# EAGLE design microframe (EAGLE 5.10)
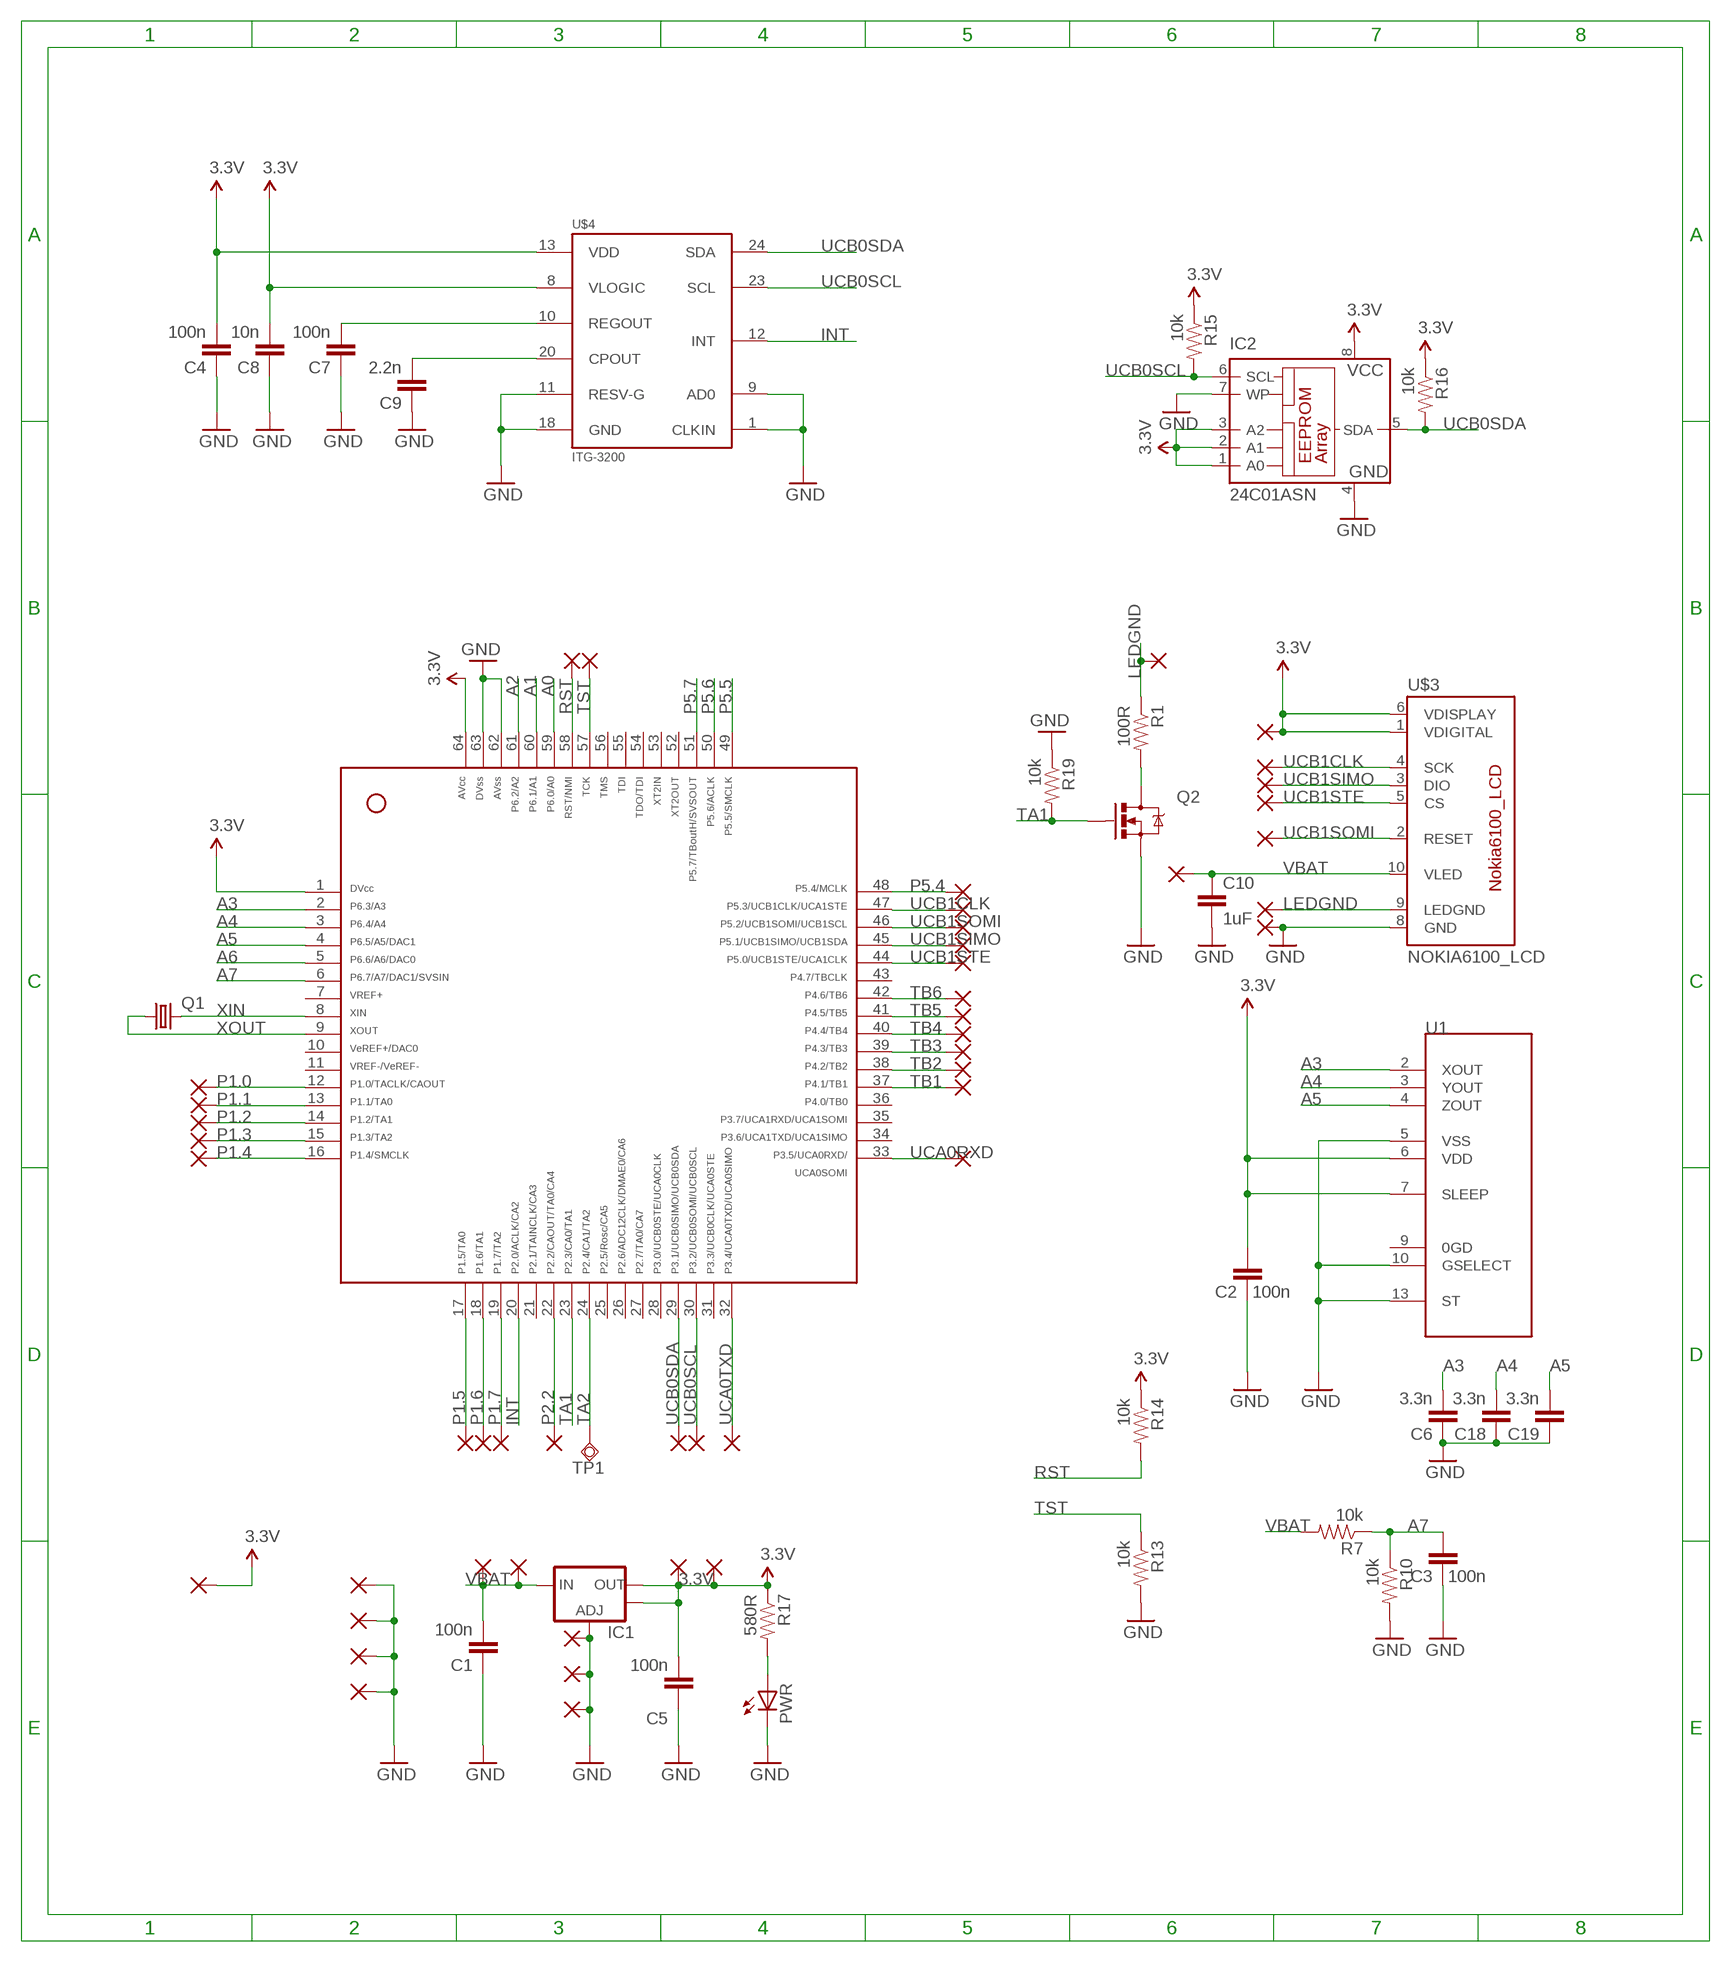
[diagram p0: schematic, sheet 1]

## Parts
C1  100n  CAP0805  [0805]
C2  100n  CAP0805  [0805]
C3  100n  CAP0805  [0805]
C4  100n  CAP0805  [0805]
C5  100n  CAP0805  [0805]
C6  3.3n  CAP0805  [0805]
C7  100n  CAP0805  [0805]
C8  10n  CAP0805  [0805]
C9  2.2n  CAP0805  [0805]
C10  1uF  CAP0805  [0805]
C18  3.3n  CAP0805  [0805]
C19  3.3n  CAP0805  [0805]
IC1  V_REG_LM1117SOT223  [SOT223]
IC2  24C01ASN  [SO-08]
PAD1  SMD2  [SMD1,27-2,54]
PAD2  SMD2  [SMD1,27-2,54]
PAD3  SMD2  [SMD1,27-2,54]
PAD4  SMD2  [SMD1,27-2,54]
PAD5  SMD2  [SMD1,27-2,54]
PAD6  SMD2  [SMD1,27-2,54]
PAD7  SMD2  [SMD1,27-2,54]
PAD8  SMD2  [SMD1,27-2,54]
PAD9  SMD2  [SMD1,27-2,54]
PAD10  SMD2  [SMD1,27-2,54]
PAD11  SMD2  [SMD1,27-2,54]
PAD12  SMD2  [SMD1,27-2,54]
PAD13  SMD2  [SMD1,27-2,54]
PAD14  SMD2  [SMD1,27-2,54]
PAD15  SMD2  [SMD1,27-2,54]
PAD16  SMD2  [SMD1,27-2,54]
PAD17  SMD2  [SMD1,27-2,54]
PAD18  SMD2  [SMD1,27-2,54]
PAD19  SMD2  [SMD1,27-2,54]
PAD20  SMD2  [SMD1,27-2,54]
PAD21  SMD2  [SMD1,27-2,54]
PAD22  SMD2  [SMD1,27-2,54]
PAD23  SMD2  [SMD1,27-2,54]
PAD24  SMD2  [SMD1,27-2,54]
PAD25  SMD2  [SMD1,27-2,54]
PAD26  SMD2  [SMD1,27-2,54]
PAD27  SMD2  [SMD1,27-2,54]
PAD28  SMD2  [SMD1,27-2,54]
PAD29  SMD2  [SMD1,27-2,54]
PAD30  SMD2  [SMD1,27-2,54]
PAD31  SMD2  [SMD1,27-2,54]
PAD32  SMD2  [SMD1,27-2,54]
PAD33  SMD2  [SMD1,27-2,54]
PAD34  SMD2  [SMD1,27-2,54]
PAD35  SMD2  [SMD1,27-2,54]
PAD36  SMD2  [SMD1,27-2,54]
PAD37  SMD2  [SMD1,27-2,54]
PAD38  SMD2  [SMD1,27-2,54]
PAD39  SMD2  [SMD1,27-2,54]
PAD40  SMD2  [SMD1,27-2,54]
PAD41  SMD2  [SMD1,27-2,54]
PAD42  SMD2  [SMD1,27-2,54]
PAD43  SMD2  [SMD1,27-2,54]
PAD44  SMD2  [SMD1,27-2,54]
PAD45  SMD2  [SMD1,27-2,54]
PAD46  SMD2  [SMD1,27-2,54]
PAD47  SMD2  [SMD1,27-2,54]
PWR  LEDCHIPLED_0603  [CHIPLED_0603]
Q1  CRYSTALHC49S  [HC49/S]
Q2  MOSFET-NCHANNELSMD  [SOT23-3]
R1  100R  RESISTOR  [0805]
R7  10k  RESISTOR  [0805]
R10  10k  RESISTOR  [0805]
R13  10k  RESISTOR  [0805]
R14  10k  RESISTOR  [0805]
R15  10k  RESISTOR  [0805]
R16  10k  RESISTOR  [0805]
R17  580R  RESISTOR  [0805]
R19  10k  RESISTOR  [0805]
TP1  TPSQTP13R  [TP13R]
U1  MMA7361  [LGA14]
U$1  F261X---PM64  [PM/PAG64]
U$3  NOKIA6100_LCD  [NOKIA6100_LCD]
U$4  ITG-3200  [QFN-24]

## Nets
3.3V: C2.2 C4.2 C5.2 C8.2 IC1.2(OUT) IC1.4(OUT) IC2.1(A0) IC2.2(A1) IC2.3(A2) IC2.8(VCC) PAD26.1(P) PAD28.1(P) PAD36.1(P) PAD44.1(P) R14.1 R15.1 R16.1 R17.1 U1.6(VDD) U1.7(SLEEP) U$1.1 U$1.64 U$3.1(VDIGITAL) U$3.6(VDISPLAY) U$4.8(VLOGIC) U$4.13(VDD)
A0: U$1.59
A1: U$1.60
A2: U$1.61
A3: C6.2 U1.2(XOUT) U$1.2
A4: C18.2 U1.3(YOUT) U$1.3
A5: C19.2 U1.4(ZOUT) U$1.4
A6: U$1.5
A7: C3.2 R7.1 R10.1 U$1.6
GND: C1.1 C2.1 C3.1 C4.1 C5.1 C6.1 C7.1 C8.1 C9.1 C10.2 C18.1 C19.1 IC1.1(ADJ) IC2.4(GND) IC2.7(WP) PAD22.1(P) PAD23.1(P) PAD24.1(P) PAD25.1(P) PAD37.1(P) PAD43.1(P) PAD46.1(P) PAD47.1(P) PWR.C Q2.2(S) R10.2 R13.2 R19.1 U1.5(VSS) U1.10(GSELECT) U1.13(ST) U$1.62 U$1.63 U$3.8(GND) U$4.1(CLKIN) U$4.9(AD0) U$4.11(RESV-G) U$4.18(GND)
INT: U$1.20 U$4.12(INT)
LEDGND: PAD35.1(P) PAD45.1(P) R1.1 U$3.9(LEDGND)
N$1: C9.2 U$4.20(CPOUT)
N$2: C7.2 U$4.10(REGOUT)
N$3: PWR.A R17.2
N$4: Q2.3(D) R1.2
P1.0: PAD1.1(P) U$1.12
P1.1: PAD2.1(P) U$1.13
P1.2: PAD3.1(P) U$1.14
P1.3: PAD4.1(P) U$1.15
P1.4: PAD5.1(P) U$1.16
P1.5: PAD6.1(P) U$1.17
P1.6: PAD7.1(P) U$1.18
P1.7: PAD8.1(P) U$1.19
P2.2: PAD9.1(P) U$1.22
P5.4: PAD29.1(P) U$1.48
P5.5: U$1.49
P5.6: U$1.50
P5.7: U$1.51
RST: PAD20.1(P) R14.2 U$1.58
TA1: Q2.1(G) R19.2 U$1.23
TA2: TP1.TP U$1.24
TB1: PAD10.1(P) U$1.37
TB2: PAD11.1(P) U$1.38
TB3: PAD12.1(P) U$1.39
TB4: PAD13.1(P) U$1.40
TB5: PAD14.1(P) U$1.41
TB6: PAD15.1(P) U$1.42
TST: PAD21.1(P) R13.1 U$1.57
UCA0RXD: PAD39.1(P) U$1.33
UCA0TXD: PAD38.1(P) U$1.32
UCB0SCL: IC2.6(SCL) PAD40.1(P) R15.2 U$1.30 U$4.23(SCL)
UCB0SDA: IC2.5(SDA) PAD41.1(P) R16.2 U$1.29 U$4.24(SDA)
UCB1CLK: PAD19.1(P) PAD30.1(P) U$1.47 U$3.4(SCK)
UCB1SIMO: PAD17.1(P) PAD31.1(P) U$1.45 U$3.3(DIO)
UCB1SOMI: PAD18.1(P) PAD33.1(P) U$1.46 U$3.2(RESET)
UCB1STE: PAD16.1(P) PAD32.1(P) U$1.44 U$3.5(CS)
VBAT: C1.2 C10.1 IC1.3(IN) PAD27.1(P) PAD34.1(P) PAD42.1(P) R7.2 U$3.10(VLED)
XIN: Q1.2 U$1.8
XOUT: Q1.1 U$1.9
Unconnected: U1.9(0GD) U$1.7 U$1.10 U$1.11 U$1.21 U$1.25 U$1.26 U$1.27 U$1.28 U$1.31 U$1.34 U$1.35 U$1.36 U$1.43 U$1.52 U$1.53 U$1.54 U$1.55 U$1.56

## Library data of the parts
C1-C10 C18 C19 = SparkFun:CAP: Capacitor Standard 0603 ceramic capacitor, and 0.1" leaded capacitor.
IC1 = SparkFun:V_REG_LM1117: Voltage Regulator LM1117 Standard adjustable voltage regulator but in SMD form. Spark Fun Electronics SKU : COM-00595
IC2 = microchip:24C*: Serial EEPROM 1 K/2 K/4 K
PAD1-PAD47 = wirepad:SMD2: SMD PAD
PWR = led:LED: LED OSRAM: - CHIPLED LG R971, LG N971, LY N971, LG Q971, LY Q971, LO R971, LY R971 LH N974, LH R974 LS Q976, LO Q976, LY Q976 LO Q996 - Hyper CHIPLED LW Q18S LB Q993, LB Q99A, LB R99A - SideLED LS A670, LO A670, LY A670, LG A670, LP A670 LB A673, LV A673, LT A673, LW A673 LH A674 LY A675 LS A676, LA A676, LO A676, LY A676, LW A676 LS A679, LY A679, LG A679 - Hyper Micro SIDELED® LS Y876, LA Y876, LO Y876, LY Y876 LT Y87S - SmartLED LW L88C, LW L88S LB L89C, LB L89S, LG L890 LS L89K, LO L89K, LY L89K LS L896, LA L896, LO L896, LY L896 - TOPLED LS T670, LO T670, LY T670, LG T670, LP T670 LSG T670, LSP T670, LSY T670, LOP T670, LYG T670 LG T671, LOG T671, LSG T671 LB T673, LV T673, LT T673, LW T673 LH T674 LS T676, LA T676, LO T676, LY T676, LB T676, LH T676, LSB T676, LW T676 LB T67C, LV T67C, LT T67C, LS T67K, LO T67K, LY T67K, LW E67C LS E67B, LA E67B, LO E67B, LY E67B, LB E67C, LV E67C, LT E67C LW T67C LS T679, LY T679, LG T679 LS T770, LO T770, LY T770, LG T770, LP T770 LB T773, LV T773, LT T773, LW T773 LH T774 LS E675, LA E675, LY E675, LS T675 LS T776, LA T776, LO T776, LY T776, LB T776 LHGB T686 LT T68C, LB T68C - Hyper Mini TOPLED® LB M676 - Mini TOPLED Santana® LG M470 LS M47K, LO M47K, LY M47K Source: http://www.osram.convergy.de LUXEON: - LUMILED® LXK2-PW12-R00, LXK2-PW12-S00, LXK2-PW14-U00, LXK2-PW14-V00 LXK2-PM12-R00, LXK2-PM12-S00, LXK2-PM14-U00 LXK2-PE12-Q00, LXK2-PE12-R00, LXK2-PE12-S00, LXK2-PE14-T00, LXK2-PE14-U00 LXK2-PB12-K00, LXK2-PB12-L00, LXK2-PB12-M00, LXK2-PB14-N00, LXK2-PB14-P00, LXK2-PB14-Q00 LXK2-PR12-L00, LXK2-PR12-M00, LXK2-PR14-Q00, LXK2-PR14-R00 LXK2-PD12-Q00, LXK2-PD12-R00, LXK2-PD12-S00 LXK2-PH12-R00, LXK2-PH12-S00 LXK2-PL12-P00, LXK2-PL12-Q00, LXK2-PL12-R00 Source: www.luxeon.com KINGBRIGHT: KA-3528ASYC Source: www.kingbright.com
Q1 = crystal:CRYSTAL: CRYSTAL
Q2 = SparkFun:MOSFET-NCHANNEL
R1 R7 R10 R13-R17 R19 = SparkFun:RESISTOR: Resistor Basic schematic elements and footprints for 0603, 1206, and PTH 1/10th watt (small) resistors.
TP1 = testpad:TPSQ: Test pad
U1 = SparkFun:MMA7361
U$1 = TI_MSP430_v15:F261X---PM64: ***MSP430F261x***PM64
U$3 = SparkFun:NOKIA6100_LCD: Nokia 6100 Color LCD Schematic element and footprint production proven but could use some touching up. Spark Fun Electronics SKU : LCD-00569. Mating SMD connector : LCD-00570
U$4 = SparkFun:ITG-3200: ITG-3200 3-axis gyro, digital output, qfn24 package

## Board
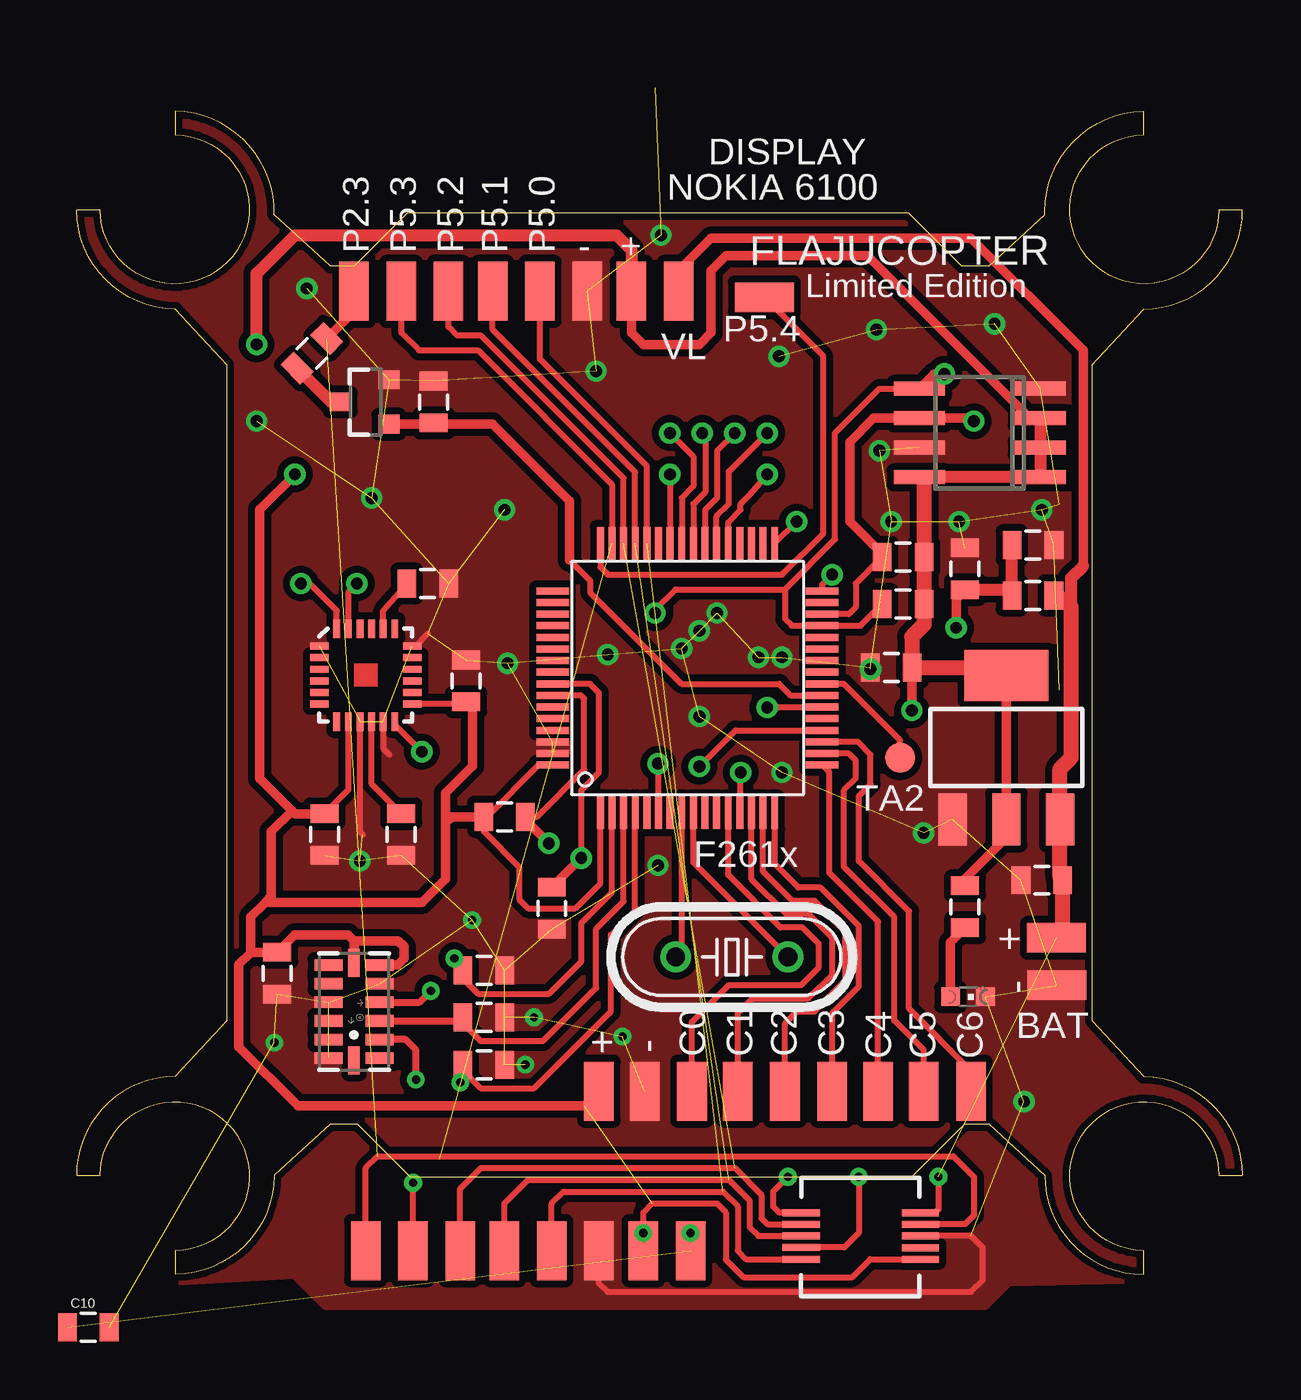
[diagram p1: board, top side]
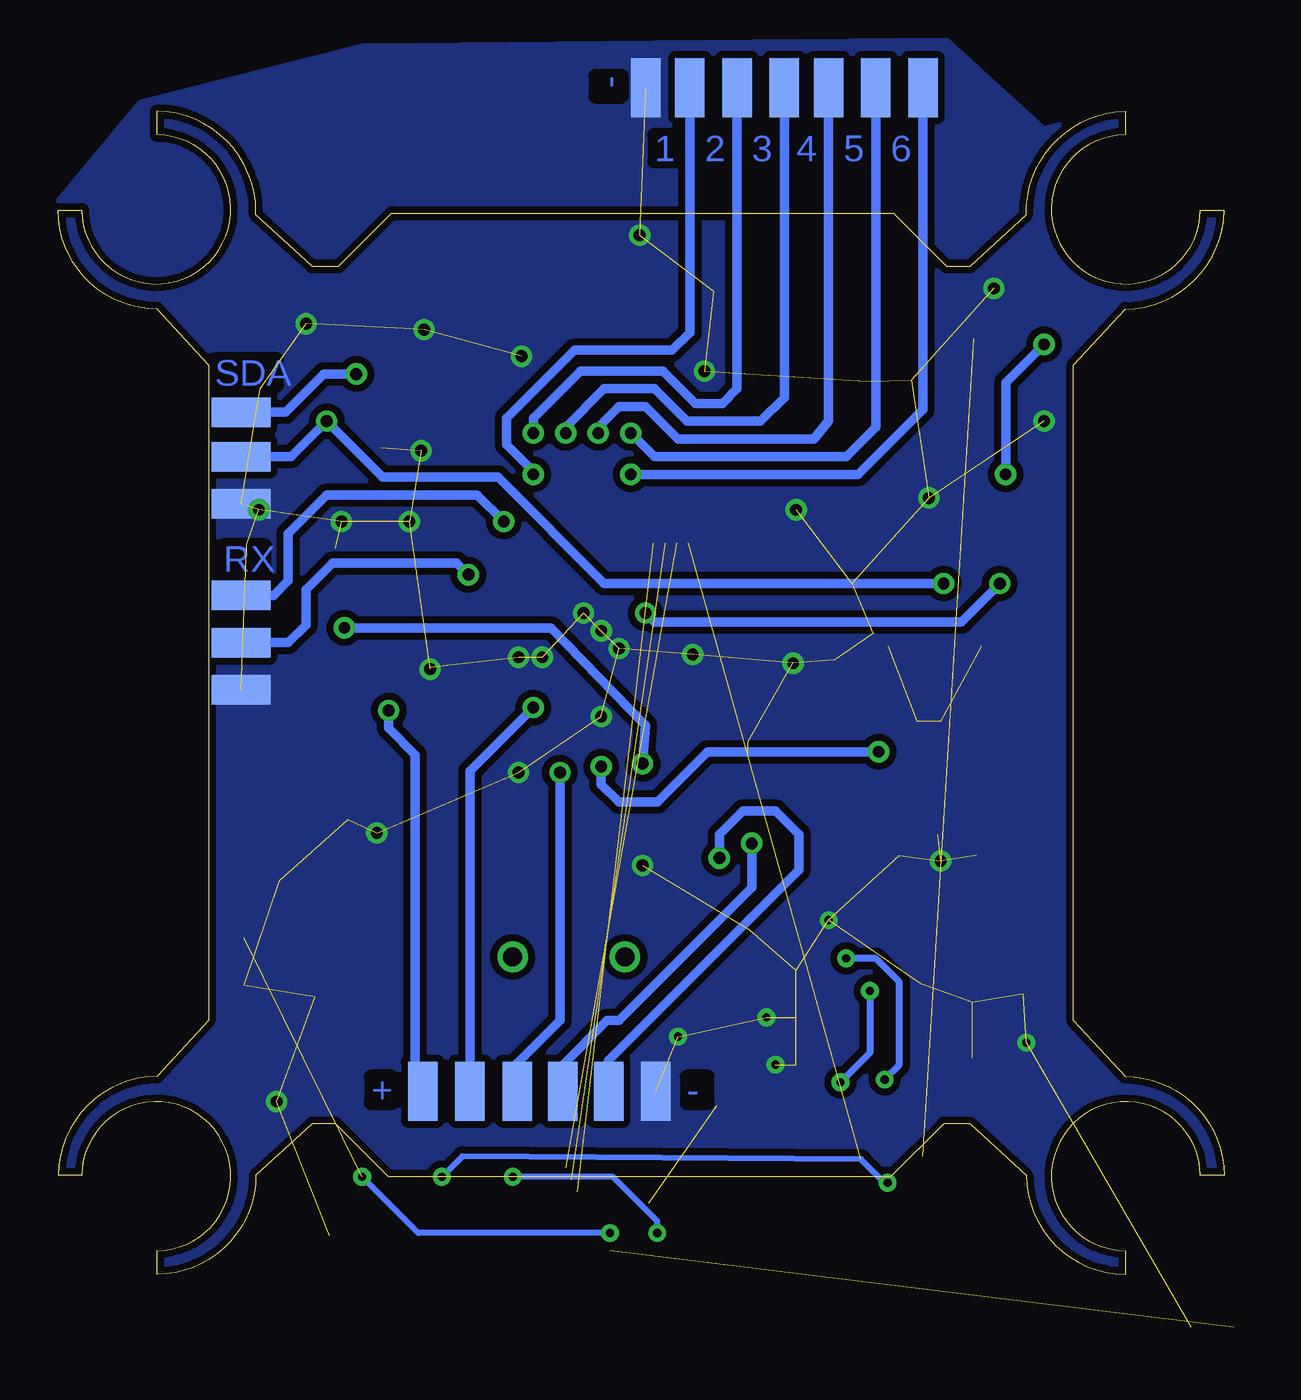
[diagram p2: board, bottom side, seen from below]

Size 50.17 x 50.04 mm. Coordinates in mm from the lower left corner, seen from the top.
Outline: 6.48,10.92 4.25,8.51 arc90 0,4.25 1.02,4.25 arc-269 4.25,1.02 4.25,0 arc89 8.51,4.25 10.92,6.48 12.07,6.48 14.35,4.19 35.94,4.19 38.23,6.48 39.24,6.48 41.66,4.25 arc90 45.91,0 45.91,1.02 arc-269 49.15,4.25 50.17,4.25 arc89 45.91,8.51 43.69,10.92 43.69,39.12 45.91,41.53 arc90 50.17,45.78 49.15,45.78 arc-269 45.91,49.02 45.91,50.04 arc89 41.66,45.72 41.66,45.59 39.24,43.37 38.1,43.37 35.81,45.66 14.22,45.66 11.94,43.37 10.92,43.37 8.51,45.59 arc90 4.25,50.04 4.25,49.02 arc-269 1.02,45.78 0,45.78 arc89 4.25,41.53 6.48,39.12 6.48,10.92
Copper layers (1*16): Top 0.035mm / dielectric 1.5mm / Bottom 0.035mm
Design rules "default *": minimum track width 10mil, minimum drill 24mil, track to track 8mil, track to pad 8mil, pad to pad 8mil, via to via 8mil, smd to smd 8mil, copper to edge 5mil, drill to drill 8mil, minimum pad ring 10mil, minimum via ring 8mil, stop-mask expansion 4mil, vias tented up to drill 0mil, thermal gap 10mil
tRestrict: area 11.4,9.9 to 12.4,12.8

### Footprints (pad centres in the part's own frame; a part is rotated, then mirrored left to right if it is on the bottom)
0805 = smd 0.8 x 1.2: 1 -0.9,0; 2 0.9,0
SOT223 = smd 1.219 x 2.235: 1 -2.311,-3.099; 2 0,-3.099; 3 2.311,-3.099 | smd 3.6 x 2.2: 4 0,3.099
SO-08 = smd 0.6 x 2.2: 1 -1.905,-2.6; 2 -0.635,-2.6; 3 0.635,-2.6; 4 1.905,-2.6; 5 1.905,2.6; 6 0.635,2.6; 7 -0.635,2.6; 8 -1.905,2.6
SMD1,27-2,54 = smd 1.27 x 2.54: 1 0,0
CHIPLED_0603 = smd 0.8 x 0.8: A 0,-0.75; C 0,0.75
HC49/S = drill 0.813 round: 1 -2.413,0; 2 2.413,0
SOT23-3 = smd 0.8 x 0.9: 1 -0.95,-1; 2 0.95,-1; 3 0,1.1
TP13R = smd 1.3 x 1.3: TP 0,0
LGA14 = smd 0.5 x 1.2: 1 2,1.1; 2 1.2,1.1; 3 0.4,1.1; 4 -0.4,1.1; 5 -1.2,1.1; 6 -2,1.1; 8 -2,-1.1; 9 -1.2,-1.1; 10 -0.4,-1.1; 11 0.4,-1.1; 12 1.2,-1.1; 13 2,-1.1 | smd 1.2 x 0.5: 7 -2.1,0; 14 2.1,0
PM/PAG64 = smd 1.4 x 0.3: 1 -5.8,3.75; 2 -5.8,3.25; 3 -5.8,2.75; 4 -5.8,2.25; 5 -5.8,1.75; 6 -5.8,1.25; 7 -5.8,0.75; 8 -5.8,0.25; 9 -5.8,-0.25; 10 -5.8,-0.75; 11 -5.8,-1.25; 12 -5.8,-1.75; 13 -5.8,-2.25; 14 -5.8,-2.75; 15 -5.8,-3.25; 16 -5.8,-3.75; 33 5.8,-3.75; 34 5.8,-3.25; 35 5.8,-2.75; 36 5.8,-2.25; 37 5.8,-1.75; 38 5.8,-1.25; 39 5.8,-0.75; 40 5.8,-0.25; 41 5.8,0.25; 42 5.8,0.75; 43 5.8,1.25; 44 5.8,1.75; 45 5.8,2.25; 46 5.8,2.75; 47 5.8,3.25; 48 5.8,3.75 | smd 0.3 x 1.4: 17 -3.75,-5.8; 18 -3.25,-5.8; 19 -2.75,-5.8; 20 -2.25,-5.8; 21 -1.75,-5.8; 22 -1.25,-5.8; 23 -0.75,-5.8; 24 -0.25,-5.8; 25 0.25,-5.8; 26 0.75,-5.8; 27 1.25,-5.8; 28 1.75,-5.8; 29 2.25,-5.8; 30 2.75,-5.8; 31 3.25,-5.8; 32 3.75,-5.8; 49 3.75,5.8; 50 3.25,5.8; 51 2.75,5.8; 52 2.25,5.8; 53 1.75,5.8; 54 1.25,5.8; 55 0.75,5.8; 56 0.25,5.8; 57 -0.25,5.8; 58 -0.75,5.8; 59 -1.25,5.8; 60 -1.75,5.8; 61 -2.25,5.8; 62 -2.75,5.8; 63 -3.25,5.8; 64 -3.75,5.8
NOKIA6100_LCD = smd 1.6 x 0.3: 1 -2.415,1.131; 2 -2.415,0.631; 3 -2.415,0.131; 4 -2.415,-0.369; 5 -2.415,-0.869; 6 2.719,-0.877; 7 2.719,-0.377; 8 2.719,0.123; 9 2.719,0.623; 10 2.719,1.123
QFN-24 = smd 0.8 x 0.3: 1 -2,1.25; 2 -2,0.75; 3 -2,0.25; 4 -2,-0.25; 5 -2,-0.75; 6 -2,-1.25; 13 2,-1.25; 14 2,-0.75; 15 2,-0.25; 16 2,0.25; 17 2,0.75; 18 2,1.25 | smd 0.3 x 0.8: 7 -1.25,-2; 8 -0.75,-2; 9 -0.25,-2; 10 0.25,-2; 11 0.75,-2; 12 1.25,-2; 19 1.25,2; 20 0.75,2; 21 0.25,2; 22 -0.25,2; 23 -0.75,2; 24 -1.25,2

### Placement (x,y rotation side)
C1  41.53,16.95 0 top
C2  8.64,12.95 90 top
C3  38.23,30.35 270 top
C4  16.76,25.53 270 top
C5  35.05,26.1 0 top
C6  17.53,13.08 180 top
C7  13.97,18.92 90 top
C8  10.67,18.92 90 top
C9  15.11,29.72 180 top
C10  0.51,-2.29 0 top
C18  17.53,11.05 180 top
C19  17.53,9.02 180 top
IC1  40,22.67 0 top
IC2  38.86,36.2 90 top
PAD1  26.48,7.87 0 top
PAD2  30.42,7.87 0 bottom
PAD3  28.45,7.87 0 top
PAD4  30.48,7.87 0 top
PAD5  32.51,7.87 0 top
PAD6  34.48,7.87 180 top
PAD7  36.45,7.87 0 top
PAD8  38.48,7.87 0 top
PAD9  32.45,7.87 0 bottom
PAD10  22.99,51.05 0 bottom
PAD11  20.95,51.05 0 bottom
PAD12  18.92,51.05 0 bottom
PAD13  17.02,51.05 0 bottom
PAD14  14.99,51.05 0 bottom
PAD15  12.95,51.05 0 bottom
PAD16  19.94,42.29 0 top
PAD17  18.41,1.02 0 top
PAD18  16,42.29 0 top
PAD19  13.97,42.29 0 top
PAD20  28.45,7.87 0 bottom
PAD21  26.48,7.87 0 bottom
PAD22  24.45,7.87 0 bottom
PAD23  42.17,12.44 90 top
PAD24  24.89,51.05 180 bottom
PAD25  24.45,7.87 0 top
PAD26  34.48,7.87 0 bottom
PAD27  42.16,14.48 90 top
PAD28  22.48,7.87 0 top
PAD29  29.59,42.04 90 top
PAD30  14.48,1.02 0 top
PAD31  17.91,42.29 0 top
PAD32  20.45,1.02 0 top
PAD33  16.51,1.02 0 top
PAD34  25.91,42.29 0 top
PAD35  11.94,42.29 0 top
PAD36  23.88,42.29 0 top
PAD37  21.97,42.29 0 top
PAD38  42.29,27.18 270 bottom
PAD39  42.29,29.21 270 bottom
PAD40  42.29,35.18 270 bottom
PAD41  42.29,37.08 270 bottom
PAD42  26.42,1.02 0 top
PAD43  22.48,1.02 0 top
PAD44  24.38,1.02 0 top
PAD45  12.45,1.02 0 top
PAD46  42.29,25.15 270 bottom
PAD47  42.29,33.15 270 bottom
PWR  38.35,11.94 270 top
Q1  28.19,13.65 180 top
Q2  12.45,37.53 90 top
R1  10.13,39.62 225 top
R7  41.15,29.21 0 top
R10  41.15,31.37 0 top
R13  20.45,15.75 270 top
R14  18.41,19.68 0 top
R15  35.56,30.86 180 top
R16  35.56,28.83 180 top
R17  38.23,15.81 270 top
R19  15.37,37.53 270 top
TP1  35.43,22.23 0 top
U1  11.94,11.3 270 top
U$1  26.29,25.65 90 top
U$3  33.59,1.52 0 top
U$4  12.45,25.78 0 top

### Tracks (layer width: path | path; a pad name or v marks a point on that pad's centre or on a via)
3.3V  (via drill 0.36, 0.51)  (1 unrouted)
  Top 0.254: U$1.1 22.54,16.82 21.46,15.75 19.43,15.75 19.05,16.13 19.05,17.53 17.53,19.05 R14.1 17.65,19.68 19.87,21.9 U$1.64 | U$3.6 34.15,0.65 33.38,-0.13 28.7,-0.13 27.94,0.64 27.94,2.67 27.56,3.05 24.77,3.05 24.38,2.67 v24.38,1.78 PAD44.1 | U$3.1 31.06,2.67 30.23,2.67 29.97,2.92 29.97,3.56 v30.61,4.19 | U$4.8 11.7,20.85 C8.2 | U$4.13 17.05,24.53 C4.2
  Top 0.406: R17.1 38.23,17.02 40,18.8 IC1.2 IC1.4 39.67,26.1 | PAD28.1 21.84,7.24 9.53,7.24 6.99,9.78 6.99,13.34 7.5,13.85 | 35.94,26.11 v35.94,24.26 | IC2.3 41.02,36.83 34.04,43.81 27.94,43.81 27.3,43.18 27.3,40.51 26.8,40.01 24.38,40.01 23.88,40.51 PAD36.1 | v9.4,34.42 7.87,32.89 7.87,21.34 9.27,19.94 | 9.27,19.94 9.4,19.81 10.66,19.81 C8.2 | 17.05,24.53 17.05,21.88 15.88,20.7 15.88,19.43 | 15.88,19.43 15.88,17.02 14.86,16 8.13,16 | 9.27,19.94 8.38,19.05 8.38,16.26 8.13,16 | 8.13,16 7.49,15.37 7.49,13.87 7.5,13.85 | R14.1 16.13,19.68 15.88,19.43 | 7.5,13.85 C2.2 9.39,14.61 11.68,14.61 11.94,14.35 | 11.94,14.35 U1.7 | U1.6 13.81,13.3 14.1,13.59 14.1,14.1 13.84,14.35 11.94,14.35
  Top 0.508: IC2.8 IC2.1 IC2.2 IC2.3 | PAD36.1 23.88,44.07 23.24,44.7 9.4,44.7 7.75,43.05 v7.75,40.01
  Top 0.635: 39.67,26.1 C5.2 35.94,26.11 35.94,27.43 36.46,27.95 R16.1 R15.1 36.46,34.09 IC2.8
  Bottom 0.254: v30.61,4.19 26.29,4.19 24.38,2.29 v24.38,1.78
  Bottom 0.406: v35.94,24.26 35.94,23.5 34.8,22.35 34.8,8.19 PAD26.1 | v9.4,34.42 9.4,38.35 v7.75,40.01
A3  (via drill 0.36)
  Top 0.254: 16.63,12.71 17.27,12.07 20.32,12.07 21.72,13.46 21.72,15.11 23.04,16.43 U$1.2
  Top 0.305: 16.63,12.71 C6.2 16.63,13.22 v16.26,13.59 | v14.61,8.38 14.61,9.65 14.15,10.1 U1.2
  Bottom 0.305: v16.26,13.59 14.99,13.59 13.97,12.57 13.97,9.02 v14.61,8.38
A4
  Top 0.254: U$1.3 23.54,16.05 22.35,14.86 22.35,12.32 20.07,10.03 17.39,10.03 16.63,10.79 C18.2
  Top 0.305: U1.3 16.48,10.9 C18.2
A5  (via drill 0.36)
  Top 0.254: U$1.4 24.04,15.66 22.99,14.61 22.99,11.3 19.69,8 17.39,8 16.63,8.76 C19.2
  Top 0.305: U1.4 14.75,11.7 v15.24,12.19 | v16.51,8.26 16.51,8.9 C19.2
  Bottom 0.305: v15.24,12.19 15.24,9.53 v16.51,8.26
A7  (via drill 0.51)
  Top 0.254: v25.02,21.97 25.04,21.95 U$1.6 | 38.48,29.46 38.47,29.45
  Top 0.406: 38.48,29.46 C3.2 37.85,29.08 v37.85,27.81
  Top 0.508: R10.1 R7.1 40,29.45 C3.2
  Bottom 0.406: v37.85,27.81 28.96,27.81 24.89,23.62 v25.02,21.97
GND  (via drill 0.36, 0.51)  (68 unrouted)
  Top 0.254: PAD43.1 22.48,-0.38 22.86,-0.76 38.48,-0.76 38.99,-0.25 38.99,1.14 38.48,1.65 36.19,1.65 U$3.8 | U$4.9 12.2,19.05 12.32,18.92 | U$4.11 13.2,22.62 13.46,22.35 | U$4.18 14.59,27.03 15.11,27.56
  other vias: 17.02,15.24 19.69,11.05 19.3,9.02 8.51,9.97 22.86,26.67 23.5,10.22 40.77,7.43 36.45,18.99 29.34,26.54 30.23,39.5 18.54,26.29 26.8,24 30.35,21.59 41.53,32.89 39.5,40.89 22.35,38.86 9.91,42.42 35.05,32.38 25.15,44.7 34.42,40.64 12.7,33.4 12.19,17.78 18.41,32.89 7.75,36.7 34.16,26.04 25.02,17.59 34.54,35.43 30.35,26.54 26.04,26.92 26.8,27.69 27.56,28.45 37.97,32.38
  pour Top (isolate 0.305, no thermals): -0.38,43.56 5.84,37.34 5.84,12.95 -0.89,6.22 -0.63,3.56 3.68,-0.38 9.33,-0.06 10.67,-1.4 39.12,-1.4 40.13,-0.38 46.23,-0.25 50.42,4.32 49.91,6.22 44.2,11.94 44.2,37.72 50.29,43.81 50.42,45.85 46.61,50.42 37.08,52.83 11.94,53.09 7.75,49.28 3.68,50.42 -0.51,45.85
  pour Bottom (isolate 0.305, no thermals): -0.38,43.56 5.84,37.34 5.84,12.95 -0.89,6.22 -0.63,3.56 3.68,-0.38 9.33,-0.06 10.67,-1.4 39.12,-1.4 40.13,-0.38 46.23,-0.25 50.42,4.32 49.91,6.22 44.2,11.94 44.2,37.72 50.29,43.81 50.42,45.85 46.61,50.42 37.08,52.83 11.94,53.09 7.75,49.28 3.68,50.42 -0.51,45.85
INT  (via drill 0.51)
  Top 0.254: U$4.12 13.7,23.64 v14.86,22.48 | v26.8,21.84 28.36,23.4 U$1.20
  Bottom 0.406: v14.86,22.48 22.23,22.48 24.38,20.32 26.04,20.32 26.8,21.08 v26.8,21.84
LEDGND  (1 unrouted)
  Top 0.254: PAD45.1 12.45,4.57 12.95,5.08 37.72,5.08 38.61,4.19 38.61,2.54 38.23,2.16 36.2,2.16 U$3.9
  Top 0.406: R1.1 11.94,41.44 PAD35.1
N$1
  Top 0.254: U$4.20 13.2,28.55 C9.2
N$2
  Top 0.254: U$4.10 12.7,21.1 C7.2
N$3
  Top 0.406: R17.2 37.6,14.29 PWR.A
N$4
  Top 0.508: Q2.3 10.95,37.53 R1.2
P1.0
  Top 0.254: U$1.12 28.04,17.17 30.29,14.92 31.24,14.92 31.94,14.22 31.94,13.21 31.18,12.45 28.07,12.45 26.48,10.86 PAD1.1
P1.1  (via drill 0.51)
  Top 0.254: v28.57,21.59 28.54,21.55 U$1.13
  Bottom 0.406: PAD2.1 30.42,9.08 28.57,10.92 v28.57,21.59
P1.2
  Top 0.254: PAD3.1 28.45,11.24 29.08,11.87 31.5,11.87 32.51,12.89 32.51,14.48 31.5,15.49 30.54,15.49 29.04,17 U$1.14
P1.3
  Top 0.254: U$1.15 29.54,17.32 30.8,16.07 31.75,16.07 33.08,14.73 33.08,12.64 31.75,11.3 30.99,11.3 30.48,10.79 PAD4.1
P1.4
  Top 0.254: U$1.16 30.04,17.65 31.05,16.64 32,16.64 33.66,14.99 33.66,12.38 32.51,11.24 PAD5.1
P1.5
  Top 0.254: PAD6.1 34.48,15.18 32.39,17.27 32.39,21.61 U$1.17
P1.6
  Top 0.254: PAD7.1 36.45,9.65 35.18,10.92 35.18,15.37 33.02,17.53 33.02,20.83 33.53,21.34 33.53,22.1 33.22,22.4 U$1.18
P1.7
  Top 0.254: U$1.19 33.61,22.9 34.16,22.35 34.16,21.08 33.66,20.57 33.66,17.78 35.81,15.62 35.81,11.43 38.48,8.76 PAD8.1
P2.2  (via drill 0.51)
  Top 0.254: v29.72,24.38 29.74,24.4 U$1.22
  Bottom 0.406: PAD9.1 32.45,21.65 v29.72,24.38
P5.4
  Top 0.254: U$1.48 22.54,30.42 22.86,30.1 30.35,30.1 32.13,31.88 32.13,39.5 PAD29.1
RST  (via drill 0.51)
  Top 0.254: U$1.58 21.7,24.9 21.84,24.77 21.84,21.72 19.81,19.68 R14.2
  Top 0.406: v20.32,18.54 19.3,19.57 R14.2
  Bottom 0.406: PAD20.1 28.45,9.02 26.54,10.92 26.04,10.92 20.32,16.64 v20.32,18.54
TA1
  Top 0.254: U$1.23 30.72,24.9 30.23,25.4 26.04,25.4 22.1,29.34 22.1,29.84 21.21,30.73
  Top 0.406: 21.21,30.73 21.21,33.27 17.91,36.58 15.42,36.58 R19.2 15.32,36.58 Q2.1
TA2
  Top 0.254: U$1.24 33.02,25.4 35.43,22.99 TP1.TP
TB1  (via drill 0.51)
  Top 0.254: v29.72,34.42 28.96,33.53 28.57,33.15 28.57,32.89 28.04,32.36 U$1.37
  Bottom 0.406: PAD10.1 22.99,40.51 23.75,39.75 27.94,39.75 30.86,36.83 30.86,35.69 29.72,34.54 v29.72,34.42
TB2  (via drill 0.51)
  Top 0.254: v29.72,36.2 28.07,34.54 28.07,33.15 27.54,32.62 U$1.38
  Bottom 0.406: PAD11.1 20.95,38.1 21.59,37.47 22.73,37.47 24.13,38.86 27.69,38.86 29.72,36.83 v29.72,36.2
TB3  (via drill 0.51)
  Top 0.254: U$1.39 27.04,32.88 27.56,33.4 27.56,35.43 v28.32,36.2
  Bottom 0.406: v28.32,36.2 28.32,36.45 26.67,38.1 24.51,38.1 23.11,36.7 19.94,36.7 18.92,37.72 PAD12.1
TB4  (via drill 0.51)
  Top 0.254: v26.92,36.2 27.05,36.07 27.05,33.66 26.54,33.15 U$1.40
  Bottom 0.406: PAD13.1 17.02,36.7 17.65,35.94 23.5,35.94 24.89,37.34 26.04,37.34 26.92,36.45 v26.92,36.2
TB5  (via drill 0.51)
  Top 0.254: v25.53,36.2 26.54,35.18 26.54,33.91 26.04,33.41 U$1.41
  Bottom 0.406: PAD14.1 14.99,36.45 16.26,35.18 24.51,35.18 v25.53,36.2
TB6  (via drill 0.51)
  Top 0.254: v25.53,34.42 25.54,33.52 U$1.42
  Bottom 0.406: PAD15.1 12.95,37.21 15.75,34.42 v25.53,34.42
TST  (via drill 0.51)
  Top 0.254: U$1.57 22.09,25.4 22.48,25.02 22.48,21.59 21.72,20.83 v21.72,17.91
  Top 0.406: v21.72,17.91 21.71,17.91 R13.1
  Bottom 0.406: PAD21.1 26.48,9.21 18.29,17.4 18.29,18.92 19.3,19.94 20.7,19.94 21.72,18.92 v21.72,17.91
UCA0RXD  (via drill 0.51)
  Top 0.254: U$1.33 30.06,31.45 v30.99,32.38
  Bottom 0.406: v30.99,32.38 32.13,33.53 38.61,33.53 40.26,31.88 40.26,29.84 40.89,29.21 PAD39.1
UCA0TXD  (via drill 0.51)
  Top 0.254: U$1.32 32.09,29.68 v32.51,30.1
  Bottom 0.406: v32.51,30.1 33.02,30.61 38.35,30.61 39.5,29.46 39.5,27.94 40.26,27.18 PAD38.1
UCB0SCL  (via drill 0.51)
  Top 0.254: U$1.30 33.23,28.4 33.53,28.7 33.53,29.73 R15.2 | U$4.23 11.7,29.35 v12.07,29.72
  Top 0.406: R15.2 34.66,31 33.27,32.38 33.27,35.81 34.29,36.83 IC2.6 38.48,36.83 v38.61,36.7
  Bottom 0.406: PAD40.1 40.13,35.18 v38.61,36.7 36.2,34.29 31.24,34.29 26.67,29.72 v12.07,29.72
UCB0SDA  (via drill 0.51)
  Top 0.254: R16.2 33.73,27.9 U$1.29 30.77,27.9 30.48,28.19 30.48,29.46 | 30.48,29.46 32.64,31.62 32.64,36.2 34.54,38.1 IC2.5 | U$4.24 11.2,28.55 10.03,29.72 v9.65,29.72 | v24.89,28.45 24.89,28.57 25.78,29.46 30.48,29.46
  Top 0.406: IC2.5 36.9,38.73 v37.34,38.73
  Bottom 0.406: v37.34,38.73 38.73,38.73 40.39,37.08 PAD41.1 | v9.65,29.72 11.3,28.07 24.51,28.07 v24.89,28.45
UCB1CLK  (via drill 0.36)  (1 unrouted)
  Top 0.254: U$1.47 23.04,33.98 17.27,39.75 14.73,39.75 13.97,40.51 PAD19.1 | PAD30.1 v14.48,3.94 | v33.66,4.19 33.66,1.78 33.03,1.16 U$3.4
  Bottom 0.254: v14.48,3.94 14.48,3.81 15.62,4.95 32.77,5.08 v33.66,4.19
UCB1SIMO  (1 unrouted)
  Top 0.254: U$1.45 24.04,34.51 17.91,40.64 PAD31.1 | PAD17.1 18.41,3.05 19.43,4.06 28.07,4.06 28.96,3.18 28.96,2.03 29.34,1.65 31.05,1.65 U$3.3
UCB1SOMI  (1 unrouted)
  Top 0.254: U$1.46 23.54,34.25 17.4,40.39 16.38,40.39 16,40.77 PAD18.1 | PAD33.1 16.51,3.68 17.4,4.57 28.32,4.57 29.46,3.43 29.46,2.41 29.72,2.16 31.05,2.16 U$3.2
UCB1STE  (1 unrouted)
  Top 0.254: U$1.44 24.54,34.77 19.94,39.37 PAD16.1 | PAD32.1 20.45,3.05 20.95,3.56 27.81,3.56 28.45,2.92 28.45,1.02 28.81,0.66 U$3.5
VBAT  (via drill 0.36)  (2 unrouted)
  Top 0.254: PAD42.1 v26.42,1.78 | v37.08,4.19 37.08,2.79 36.96,2.67 36.2,2.67 U$3.10
  Top 0.406: PAD27.1 42.43,14.74 | C1.2 42.32,17.07 | 43.31,30.48 43.31,39.75 38.48,44.58 27.3,44.58 25.91,43.18 PAD34.1
  Top 0.508: R7.2 42.3,29.21 42.8,28.71 42.8,29.97 43.31,30.48
  Top 0.635: 42.43,14.74 C1.2 | 42.32,17.07 IC1.3 42.32,21.74 42.8,22.23 42.8,28.71
  Bottom 0.254: v26.42,1.78 34.67,1.78 v37.08,4.19
XIN
  Top 0.254: U$1.8 26.04,13.91 Q1.2
XOUT
  Top 0.254: U$1.9 26.54,17.72 Q1.1

### Text on the board
Bottom: - | 6 | 5 | 4 | 3 | 2 | 1 | SDA | RX | - | +
tNames: DISPLAY | NOKIA 6100 | P2.3 | P5.3 | P5.2 | P5.1 | P5.0 | - | + | FLAJUCOPTER | Limited Edition | P5.4 | VL | TA2 | F261x | + | - | C0 | C1 | C2 | C3 | BAT | - | + | C4 | C5 | C6
_tNames: R1 | R19 | R15 | R10 | C9 | R16 | C3 | R7 | C4 | C5 | R14 | C8 | C7 | R13 | R17 | C1 | Q1 | C6 | C18 | PWR | C2 | C19